# EAGLE design Pulvertech_basic (EAGLE 8.2.2)
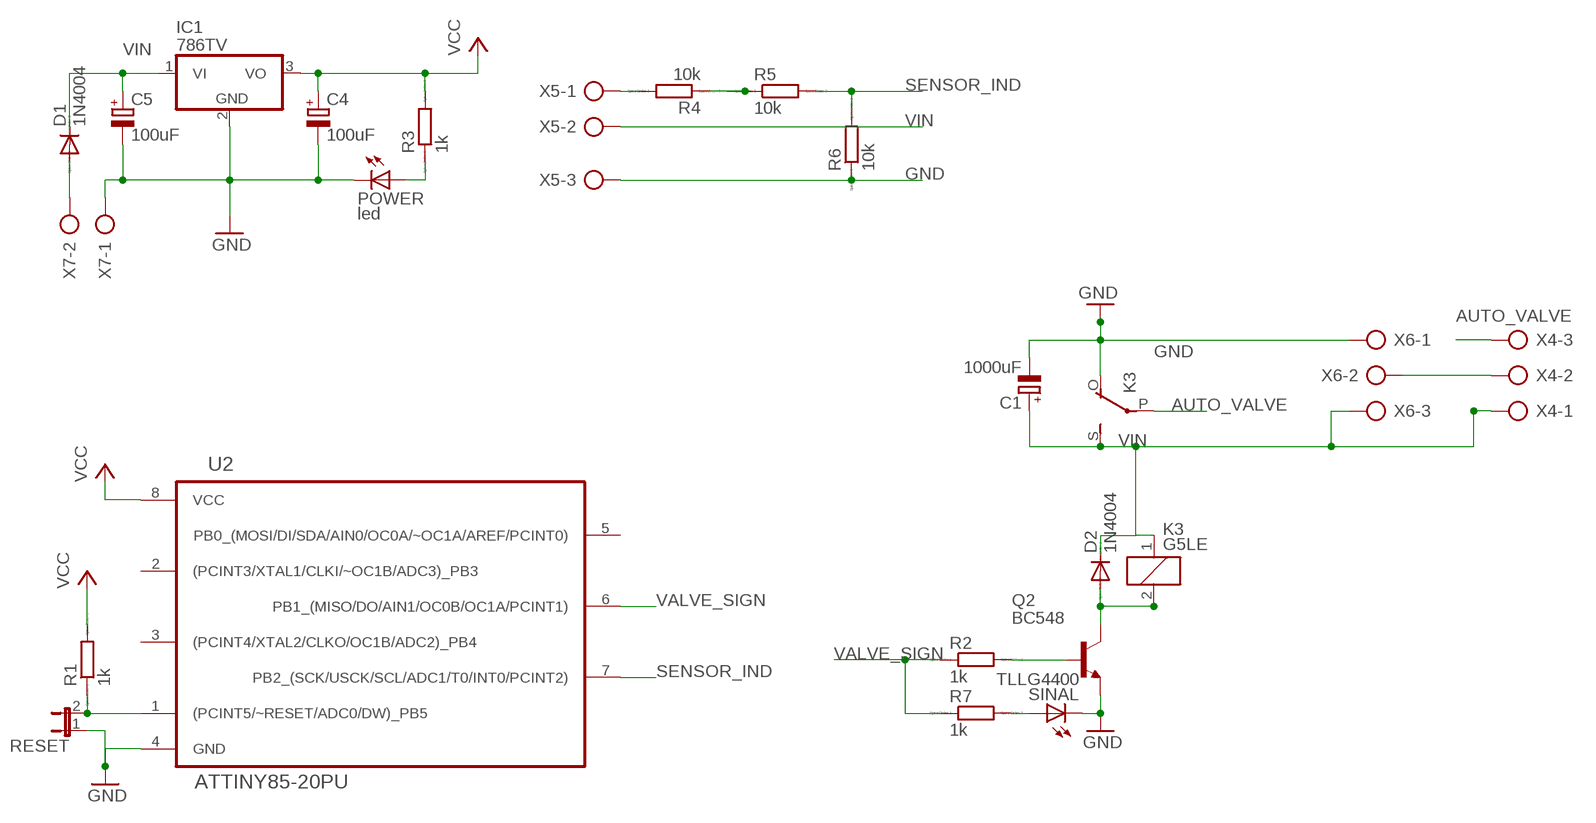
[diagram p0: schematic, sheet 1]

## Parts
C1  1000uF  CPOL-EUE5-10.5  [E5-10,5]
C4  100uF  CPOL-EUE2.5-5  [E2,5-5]
C5  100uF  CPOL-EUE2.5-5  [E2,5-5]
D1  1N4004  [DO41-10]
D2  1N4004  [DO41-10]
IC1  786TV  [TO220V]
K3  G5LE  [G5LE]
POWER  led  LED3MM  [LED3MM]
Q2  BC548  [TO92-EBC]
R1  1k  R0204/7  [0204/7]
R2  1k  R0204/7  [0204/7]
R3  1k  R0204/7  [0204/7]
R4  10k  R0204/7  [0204/7]
R5  10k  R0204/7  [0204/7]
R6  10k  R0204/7  [0204/7]
R7  1k  R0204/7  [0204/7]
RESET  JP1E  [JP1]
SINAL  TLLG4400  [LED3MM]
U2  ATTINY85-20PU  [DIP254P762X533-8]
X4  AK500/3  [AK500/3]
X5  AK500/3  [AK500/3]
X6  AK500/3  [AK500/3]
X7  AK500/2  [AK500/2]

## Nets
AUTO_VALVE: K3.P(2:P) X4.3
GND: C1.- C4.- C5.- IC1.2(GND) K3.O(2:O) POWER.K(C) Q2.E R6.1 RESET.1 SINAL.K(C) U2.4(GND) X5.3 X6.1 X7.1
N$1: R1.1 RESET.2 U2.1((PCINT5/~RESET/ADC0/DW)_PB5)
N$2: R4.2 X5.1
N$3: Q2.B R2.2
N$4: X4.2 X6.2
N$5: D1.A X7.2
N$6: R7.2 SINAL.A
N$9: POWER.A R3.1
N$13: D2.A K3.2 Q2.C
N$31: R4.1 R5.1
SENSOR_IND: R5.2 R6.2 U2.7(PB2_(SCK/USCK/SCL/ADC1/T0/INT0/PCINT2))
VALVE_SIGN: R2.1 R7.1 U2.6(PB1_(MISO/DO/AIN1/OC0B/OC1A/PCINT1))
VCC: C4.+ IC1.3(VO) R1.2 R3.2 U2.8(VCC)
VIN: C1.+ C5.+ D1.C D2.C IC1.1(VI) K3.1 K3.S(2:S) X4.1 X5.2 X6.3
Unconnected: U2.2((PCINT3/XTAL1/CLKI/~OC1B/ADC3)_PB3) U2.3((PCINT4/XTAL2/CLKO/OC1B/ADC2)_PB4) U2.5(PB0_(MOSI/DI/SDA/AIN0/OC0A/~OC1A/AREF/PCINT0))

## Library data of the parts
C1 C4 C5 = resistor:CPOL-EU: POLARIZED CAPACITOR, European symbol
D1 D2 = diode:1N4004: DIODE general purpose rectifier, 1 A
IC1 = linear:78*: Positive VOLTAGE REGULATOR Source: http://cache.national.com/ds/LM/LM78L05.pdf http://www.fairchildsemi.com/ds/LM/LM7805.pdf
K3 = relay:G5LE: RELAY 1 x switch, 10 A/120 V AC, 8 A/30 V DC, Omron; OC_FARNELL: unknown; OC_NEWARK: unknown
POWER = led:LED: LED OSRAM: - CHIPLED LG R971, LG N971, LY N971, LG Q971, LY Q971, LO R971, LY R971 LH N974, LH R974 LS Q976, LO Q976, LY Q976 LO Q996 - Hyper CHIPLED LW Q18S LB Q993, LB Q99A, LB R99A - SideLED LS A670, LO A670, LY A670, LG A670, LP A670 LB A673, LV A673, LT A673, LW A673 LH A674 LY A675 LS A676, LA A676, LO A676, LY A676, LW A676 LS A679, LY A679, LG A679 - Hyper Micro SIDELED® LS Y876, LA Y876, LO Y876, LY Y876 LT Y87S - SmartLED LW L88C, LW L88S LB L89C, LB L89S, LG L890 LS L89K, LO L89K, LY L89K LS L896, LA L896, LO L896, LY L896 - TOPLED LS T670, LO T670, LY T670, LG T670, LP T670 LSG T670, LSP T670, LSY T670, LOP T670, LYG T670 LG T671, LOG T671, LSG T671 LB T673, LV T673, LT T673, LW T673 LH T674 LS T676, LA T676, LO T676, LY T676, LB T676, LH T676, LSB T676, LW T676 LB T67C, LV T67C, LT T67C, LS T67K, LO T67K, LY T67K, LW E67C LS E67B, LA E67B, LO E67B, LY E67B, LB E67C, LV E67C, LT E67C LW T67C LS T679, LY T679, LG T679 LS T770, LO T770, LY T770, LG T770, LP T770 LB T773, LV T773, LT T773, LW T773 LH T774 LS E675, LA E675, LY E675, LS T675 LS T776, LA T776, LO T776, LY T776, LB T776 LHGB T686 LT T68C, LB T68C - Hyper Mini TOPLED® LB M676 - Mini TOPLED Santana® LG M470 LS M47K, LO M47K, LY M47K Source: http://www.osram.convergy.de LUXEON: - LUMILED® LXK2-PW12-R00, LXK2-PW12-S00, LXK2-PW14-U00, LXK2-PW14-V00 LXK2-PM12-R00, LXK2-PM12-S00, LXK2-PM14-U00 LXK2-PE12-Q00, LXK2-PE12-R00, LXK2-PE12-S00, LXK2-PE14-T00, LXK2-PE14-U00 LXK2-PB12-K00, LXK2-PB12-L00, LXK2-PB12-M00, LXK2-PB14-N00, LXK2-PB14-P00, LXK2-PB14-Q00 LXK2-PR12-L00, LXK2-PR12-M00, LXK2-PR14-Q00, LXK2-PR14-R00 LXK2-PD12-Q00, LXK2-PD12-R00, LXK2-PD12-S00 LXK2-PH12-R00, LXK2-PH12-S00 LXK2-PL12-P00, LXK2-PL12-Q00, LXK2-PL12-R00 Source: www.luxeon.com KINGBRIGHT: KA-3528ASYC Source: www.kingbright.com
Q2 = transistor-npn:BC548*: NPN Transistor
R1-R7 = eagle-ltspice:R: RESISTOR, European symbol; SPICEMODEL: NONE; SPICEPREFIX: R
RESET = jumper:JP1E: JUMPER
SINAL = led:TLLG4400: Low Current (2mA) LED 3 mm Tinted Diffused Package color GREEN Source: Data sheet <http://www.farnell.com/datasheets/391098.pdf>; MF: VISHAY SEMICONDUCTOR; OC_FARNELL: 1612435
U2 = Atmel_By_element14_Batch_1-00:ATTINY85-20PU: 8-bit Microcontroller with In-System Programmable Flash; MPN: ATTINY85-20PU; OC_FARNELL: 1455162; OC_NEWARK: 58M3796; PACKAGE: PDIP-8; SUPPLIER: Atmel
X4-X6 = con-ptr500:AK500/3: CONNECTOR; OC_FARNELL: unknown; OC_NEWARK: unknown
X7 = con-ptr500:AK500/2: CONNECTOR; OC_FARNELL: unknown; OC_NEWARK: unknown

## Net classes
0 default: width 0.813 mm, clearance 0.508 mm

## Board
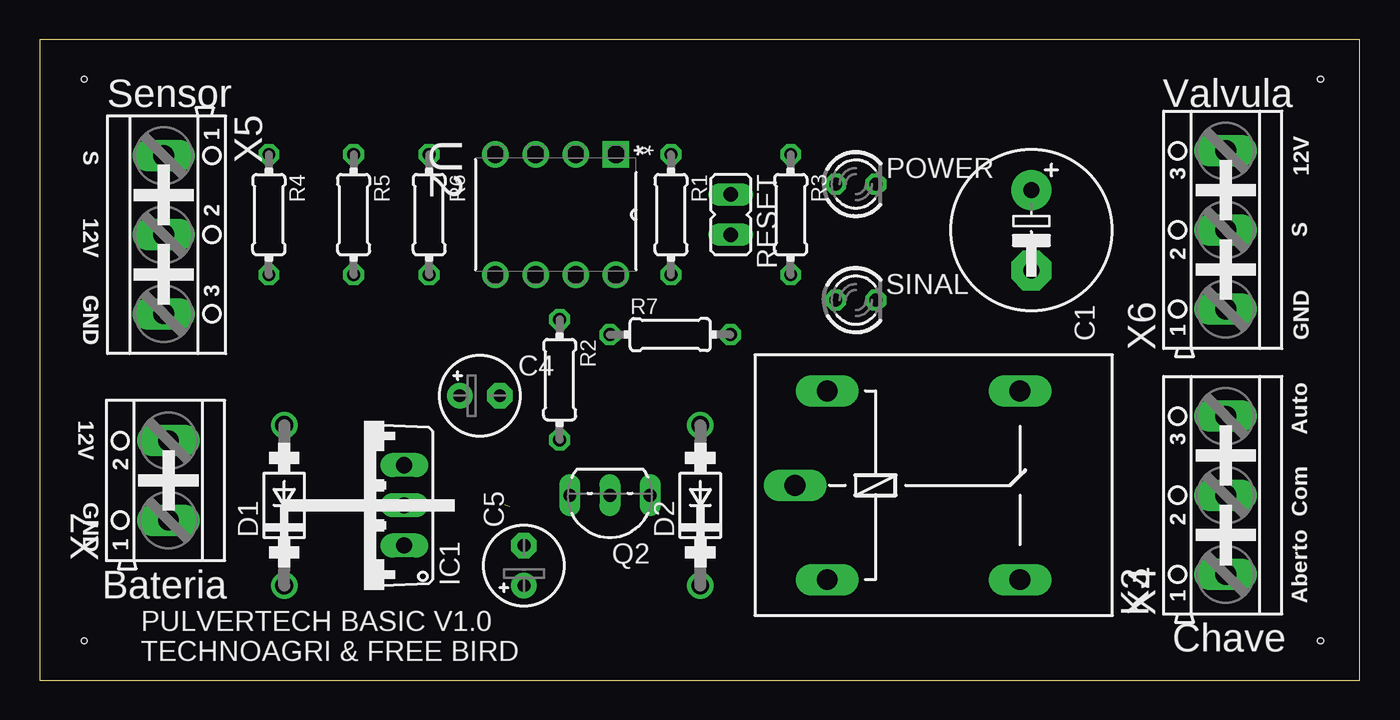
[diagram p1: board, top side]
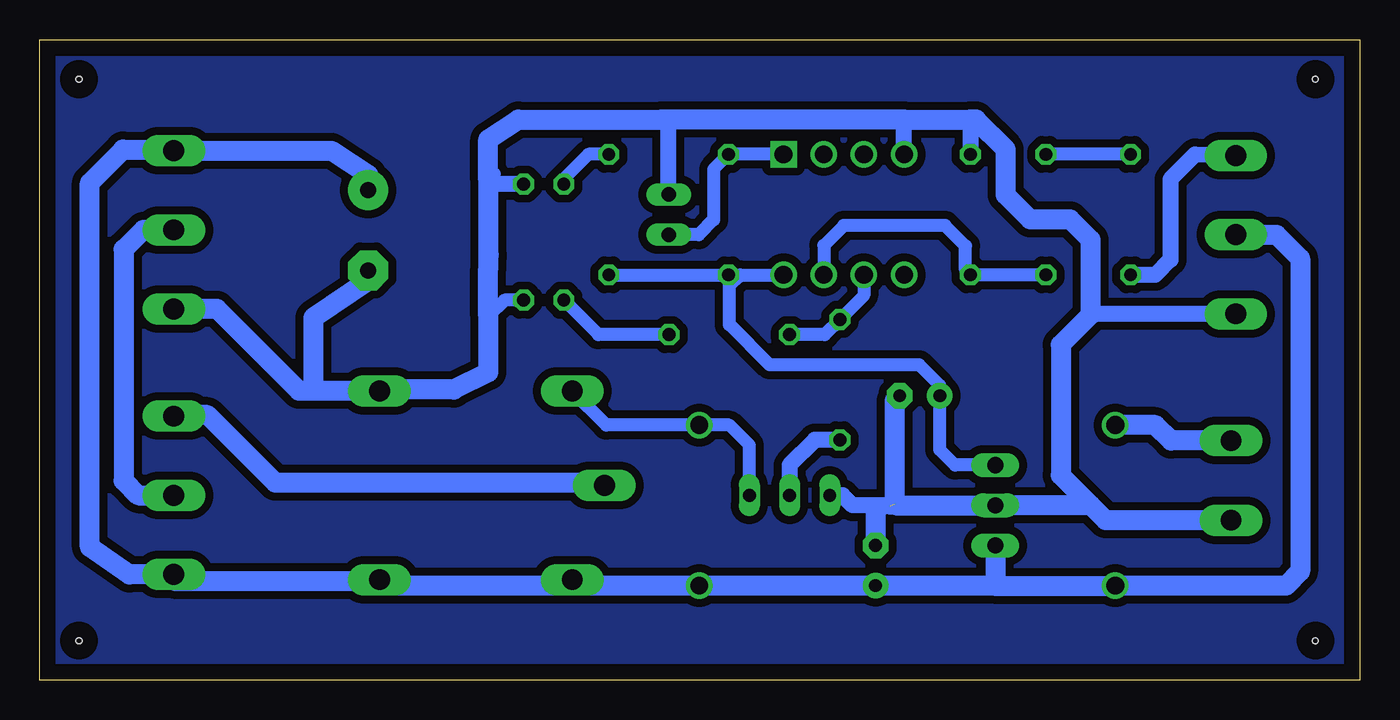
[diagram p2: board, bottom side, seen from below]

Size 83.5 x 40.54 mm. Coordinates in mm from the lower left corner, seen from the top.
Outline: 0,40.54 0,0 83.5,0 83.5,40.54 0,40.54
Copper layers (1*16): Top 0.035mm / dielectric 1.5mm / Bottom 0.035mm
Design rules "default": minimum track width 6mil, minimum drill 0.35mm, track to track 6mil, track to pad 6mil, pad to pad 6mil, via to via 6mil, smd to smd 6mil, copper to edge 40mil, drill to drill 6mil, minimum pad ring 10mil, minimum via ring 8mil, stop-mask expansion 4mil, vias tented up to drill 0mil, thermal gap 10mil
Holes 0.35 mm at 2.82,38.02 81,38.02 81,2.51 2.82,2.51

### Footprints (pad centres in the part's own frame; a part is rotated, then mirrored left to right if it is on the bottom)
E5-10,5 = drill 1.016 pad 2.54: + -2.54,0 | drill 1.016 pad 2.54 octagon: - 2.54,0
E2,5-5 = drill 0.813 pad 1.6: + -1.27,0 | drill 0.813 pad 1.6 octagon: - 1.27,0
DO41-10 = drill 1.118: A 5.08,0; C -5.08,0
TO220V = drill 1.016 long: 1 -2.54,-2.54; 2 0,-2.54; 3 2.54,-2.54
G5LE = drill 1.321 long: 1 -7.493,-5.969; 2 -7.493,5.969; O 4.699,5.969; P -9.525,0; S 4.699,-5.969
LED3MM = drill 0.813 octagon: A -1.27,0; K 1.27,0
TO92-EBC = drill 0.813 long: B 0,-1.27; C -2.54,-1.27; E 2.54,-1.27
0204/7 = drill 0.813 octagon: 1 -3.81,0; 2 3.81,0
JP1 = drill 0.914 long: 1 0,-1.27; 2 0,1.27
DIP254P762X533-8 = drill 1.118 square: 1 -7.62,7.62 | drill 1.118: 2 -7.62,5.08; 3 -7.62,2.54; 4 -7.62,0; 5 0,0; 6 0,2.54; 7 0,5.08; 8 0,7.62
AK500/3 = drill 1.321 long: 1 -5.004,0; 2 0,0; 3 5.004,0
AK500/2 = drill 1.321 long: 1 -2.515,0; 2 2.515,0

### Placement (x,y rotation side)
C1  62.71,28.47 270 top
C4  27.84,18.01 0 top
C5  30.63,7.26 90 top
D1  15.47,11.07 90 top
D2  41.78,11.07 90 top
IC1  20.52,11.07 90 top
K3  57.3,12.34 0 top
POWER  51.61,31.39 0 top
Q2  36.07,10.44 180 top
R1  39.93,29.46 270 top
R2  32.89,19.02 270 top
R3  47.5,29.46 270 top
R4  14.5,29.46 270 top
R5  19.86,29.46 270 top
R6  24.64,29.46 270 top
R7  39.88,21.87 0 top
RESET  43.71,29.46 180 top
SINAL  51.61,24.05 0 top
U2  28.83,25.65 270 top
X4  75.01,11.71 90 top
X5  7.85,28.19 270 top
X6  75.01,28.5 90 top
X7  8.15,12.65 90 top

### Tracks (layer width: path | path; a pad name or v marks a point on that pad's centre or on a via)
AUTO_VALVE
  Bottom 1.016: 74.93,16.79 X4.3
  Bottom 1.27: K3.P 47.93,12.5 68.58,12.5 72.87,16.79 74.93,16.79
GND  (1 unrouted)
  Bottom 0.813: RESET.1 43.71,35.55 | 54.86,26.95 55.12,26.05 | 54.74,32.03 55.12,31.65 | SINAL.K 54.1,24.05 55.12,23.04 | 29.41,11.12 30.63,10.67
  Bottom 1.016: Q2.E 32.72,11.71 32.08,11.07 29.79,11.07 29.72,11 | 24.64,35.48 R6.1 | X5.3 16.97,23.19 17.02,23.14 | U2.4 28.83,35.48 | POWER.K 54.86,31.39 55.12,31.65 | RESET.1 43.71,35 44.2,35.48
  Bottom 1.27: X7.1 16.08,10.13 17.02,11.07 | 17.02,11.07 18.92,12.98 18.92,21.23 17.02,23.14 17.02,27.86 18.31,29.16 20.85,29.16 22.4,30.71 22.4,33.6 24.28,35.48 24.64,35.48 28.83,35.48 44.2,35.48 53.21,35.48 55.12,34.21 55.12,31.65 55.12,26.05 55.12,23.04 55.12,19.48 57.3,18.39 61.92,18.39 K3.O | 17.02,11.07 IC1.2 29.36,11.07 29.41,11.12 29.41,17.7 C4.- | 30.63,10.67 C5.- | 61.75,18.06 K3.O | K3.O 66.19,18.31 | 66.19,18.31 66.19,22.94 62.68,25.28 62.71,25.29 C1.- | 66.19,18.31 67.08,18.31 72.26,23.5 X6.1
N$1
  Bottom 0.813: U2.1 R1.1 40.87,32.33 40.87,29.13 41.81,28.19 RESET.2
N$2
  Bottom 1.016: X5.1 10.43,33.26 11.99,31.7 11.99,26.62 12.95,25.65 R4.2
N$3
  Bottom 1.016: R2.2 34.47,15.21 36.07,13.61 Q2.B
N$4
  Bottom 1.27: X6.2 76.94,28.5 78.18,27.25 78.18,12.65 77.24,11.71 X4.2
N$5
  Bottom 1.27: X7.2 11.94,15.16 12.93,16.15 D1.A
N$6
  Bottom 0.813: R7.2 48.16,21.87 SINAL.A
N$7
  pour Bottom: 0,40.54 83.52,40.54 83.52,0 0,0
N$9
  Bottom 0.813: R3.1 48.79,33.27 50.34,31.73 POWER.A
N$13
  Bottom 0.813: 49.81,18.19 K3.2 47.65,16.15 D2.A 39.88,16.15 38.61,14.88 Q2.C
N$31
  Bottom 0.813: R4.1 R5.1
SENSOR_IND
  Bottom 0.813: R5.2 R6.2 24.94,25.96 24.94,27.48 26.24,28.78 32.64,28.78 33.91,27.51 U2.7
VALVE_SIGN
  Bottom 0.813: U2.6 31.37,24.36 R2.1 33.86,21.87 R7.1
VCC
  Bottom 0.813: 39.18,25.65 U2.8 | 39.18,25.65 R1.2 R3.2 | IC1.3 25.6,13.61 26.57,14.58 C4.+ 26.57,18.67 27.86,19.96 37.34,19.96 39.88,22.5 39.88,24.96 39.79,25.04 39.49,25.35 39.18,25.65
VIN
  Bottom 1.016: 49.43,5.99 K3.1 | 74.68,6.38 X4.1
  Bottom 1.27: X5.2 5.28,28.19 3.79,26.7 3.79,6.88 4.67,5.99 D1.C 23.14,5.99 | 48.76,5.99 61.09,5.99 61.09,6 61.09,6.3 62,6.3 | 48.76,5.99 D2.C C5.+ 23.14,5.99 | 62,6.3 75.01,6.3 X4.1 77.82,6.71 80.32,8.44 80.32,31.46 78.21,33.58 75.08,33.58 X6.3 65.03,33.5 62.71,31.99 C1.+ | K3.S 62,6.3 | K3.1 49.14,6.38 48.76,5.99 | IC1.1 23.06,6.07 23.14,5.99

### Text on the board
_tplace: Sensor | Valvula | 1 | S | * | 12V | 3 | 2 | 12V | S | 2 | 3 | GND | GND | GND | 1 | 12V | Auto | 3 | 2 | GND | 2 | Com | 1 | Bateria | 1 | Aberto | Chave | PULVERTECH BASIC V1.0 / TECHNOAGRI & FREE BIRD